# EAGLE design PocketPowerSource4.3 (EAGLE 6.4)

## Sheet 1 of 3
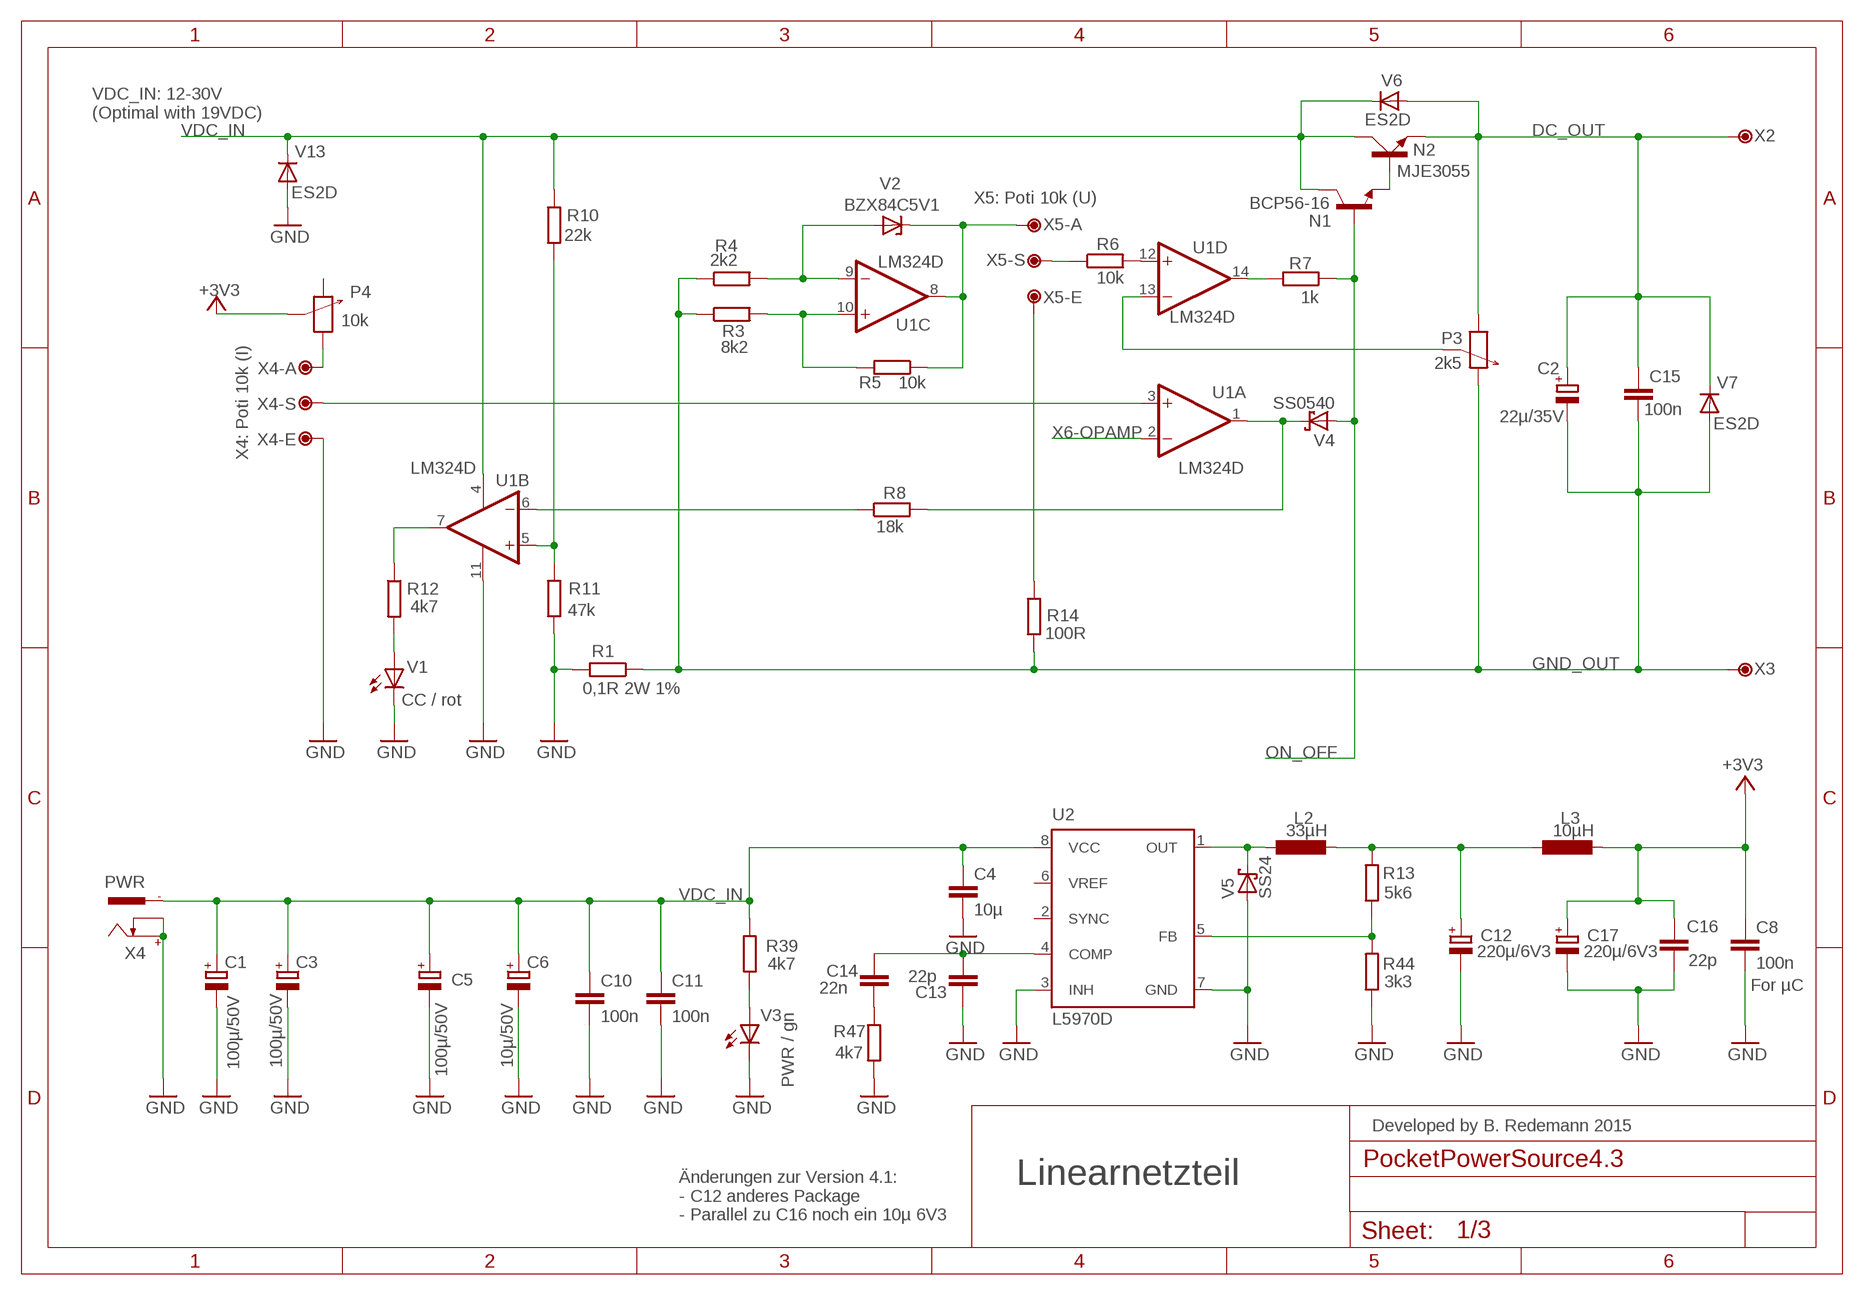
[diagram p0: schematic, sheet 1]

### Parts
C1  100µ/50V  CPOL-EUF  [PANASONIC_F]
C2  22µ/35V  CPOL-EUC  [PANASONIC_C]
C3  100µ/50V  CPOL-EUF  [PANASONIC_F]
C4  10µ  C-EUC1210  [C1210]
C5  100µ/50V  CPOL-EUF  [PANASONIC_F]
C6  10µ/50V  CPOL-EUD  [PANASONIC_D]
C8  100n  C-EUC0603K  [C0603K]
C10  100n  C-EUC0603K  [C0603K]
C11  100n  C-EUC0603K  [C0603K]
C12  220µ/6V3  CPOL-EUD  [PANASONIC_D]
C13  22p  C-EUC0805  [C0805]
C14  22n  C-EUC1206  [C1206]
C15  100n  C-EUC0603K  [C0603K]
C16  22p  C-EUC0805  [C0805]
C17  220µ/6V3  CPOL-EUD  [PANASONIC_D]
L2  33µH  L-EUWE-TPC  [POWER-CHOKE_WE-TPC]
L3  10µH  L-EUL4540  [L4540]
N1  BCP56-16  BCP56  [PG-SOT-223]
N2  MJE3055  [TO220AV]
P3  2k5  PT6  [PT6]
P4  10k  PT6  [PT6]
R1  0,1R 2W 1%  R-EU_R2512  [R2512]
R3  8k2  R-EU_R0603  [R0603]
R4  2k2  R-EU_R0805  [R0805]
R5  10k  R-EU_R0603  [R0603]
R6  10k  R-EU_R0603  [R0603]
R7  1k  R-EU_R0603  [R0603]
R8  18k  R-EU_R1206  [R1206]
R10  22k  R-EU_R0603  [R0603]
R11  47k  R-EU_R0603  [R0603]
R12  4k7  R-EU_R1206  [R1206]
R13  5k6  R-EU_R0603  [R0603]
R14  100R  R-EU_R0603  [R0603]
R39  4k7  R-EU_R1206  [R1206]
R44  3k3  R-EU_R0603  [R0603]
R47  4k7  R-EU_R1206  [R1206]
U1  LM324D  [SO14]
U2  L5970D  [SO08]
V1  CC / rot  LED3MM  [LED3MM]
V2  BZX84C5V1  BZX84CSMD  [TO236]
V3  PWR / gn  LED3MM  [LED3MM]
V4  SS0540  [SOD123]
V5  SS24  MBRS130LT3  [SMB]
V6  ES2D  [SMB]
V7  ES2D  [SMB]
V13  ES2D  [SMB]
X2  DC_OUT  TPPAD1-13  [P1-13]
X3  GND_OUT  TPPAD1-13  [P1-13]
X4  PWR  737992-55  [737992-5]
X4-A  P_I-A  TPPAD1-13  [P1-13]
X4-E  P_I-E  TPPAD1-13  [P1-13]
X4-S  P_I-W  TPPAD1-13  [P1-13]
X5-A  P_U-A  TPPAD1-13  [P1-13]
X5-E  P_U-E  TPPAD1-13  [P1-13]
X5-S  P_U-S  TPPAD1-13  [P1-13]

### Nets
+3V3: C8.1 C16.2 C17.+ L3.P$2 P4.WIPER(1S) ; also sheet 3
DC_OUT: C2.+ C15.1 N2.E P3.RIGHT(1E) V6.A V7.C X2.TP ; also sheet 2,3
GND: C1.- C3.- C4.2 C5.- C6.- C8.2 C10.2 C11.2 C12.- C13.1 C16.1 C17.- R1.2 R11.1 R44.1 R47.1 U1.11(P:V-) U2.3(INH) U2.7(GND) V1.K(C) V3.K(C) V5.A V13.A X4-E.TP X4.+ X4.K ; also sheet 2,3
GND_OUT: C2.- C15.2 P3.LEFT(1A) R1.1 R3.1 R4.1 R14.2 V7.A X3.TP ; also sheet 2,3
N$2: R8.1 U1.6(B:-IN)
N$3: R5.1 U1.8(C:OUT) V2.C X5-A.TP
N$4: R12.1 U1.7(B:OUT)
N$6: P4.RIGHT(1E) X4-A.TP
N$7: R12.2 V1.A
N$8: R8.2 U1.1(A:OUT) V4.C
N$10: R3.2 R5.2 U1.10(C:+IN)
N$11: R4.2 U1.9(C:-IN) V2.A
N$12: N1.3(E) N2.B
N$14: R7.2 U1.14(D:OUT)
N$17: C13.2 C14.1 U2.4(COMP)
N$18: R10.1 R11.2 U1.5(B:+IN)
N$19: R6.2 U1.12(D:+IN)
N$20: P3.WIPER(1S) U1.13(D:-IN)
N$21: R6.1 X5-S.TP
N$23: R14.1 X5-E.TP
N$24: U1.3(A:+IN) X4-S.TP
N$25: C12.+ L2.2 L3.P$1 R13.2
N$35: R39.1 V3.A
N$59: R13.1 R44.2 U2.5(FB)
N$60: C14.2 R47.2
N$61: L2.1 U2.1(OUT) V5.C
ON_OFF: N1.1(B) R7.1 V4.A ; also sheet 2
VDC_IN: C1.+ C3.+ C4.1 C5.+ C6.+ C10.1 C11.1 N1.2(C) N1.4(C) N2.C R10.2 R39.2 U1.4(P:V+) U2.8(VCC) V6.C V13.C X4.-1 ; also sheet 2
X6-OPAMP: U1.2(A:-IN) ; also sheet 2
Unconnected: P4.LEFT(1A) U2.2(SYNC) U2.6(VREF) X4.-2

### Notes on the sheet
- VDC_IN: 12-30V
  (Optimal with 19VDC)
- X5: Poti 10k (U)
- X4: Poti 10k (I)
- For µC
- Developed by B. Redemann 2015
- Linearnetzteil
- Änderungen zur Version 4.1:
  - C12 anderes Package
  - Parallel zu C16 noch ein 10µ 6V3

## Sheet 2 of 3
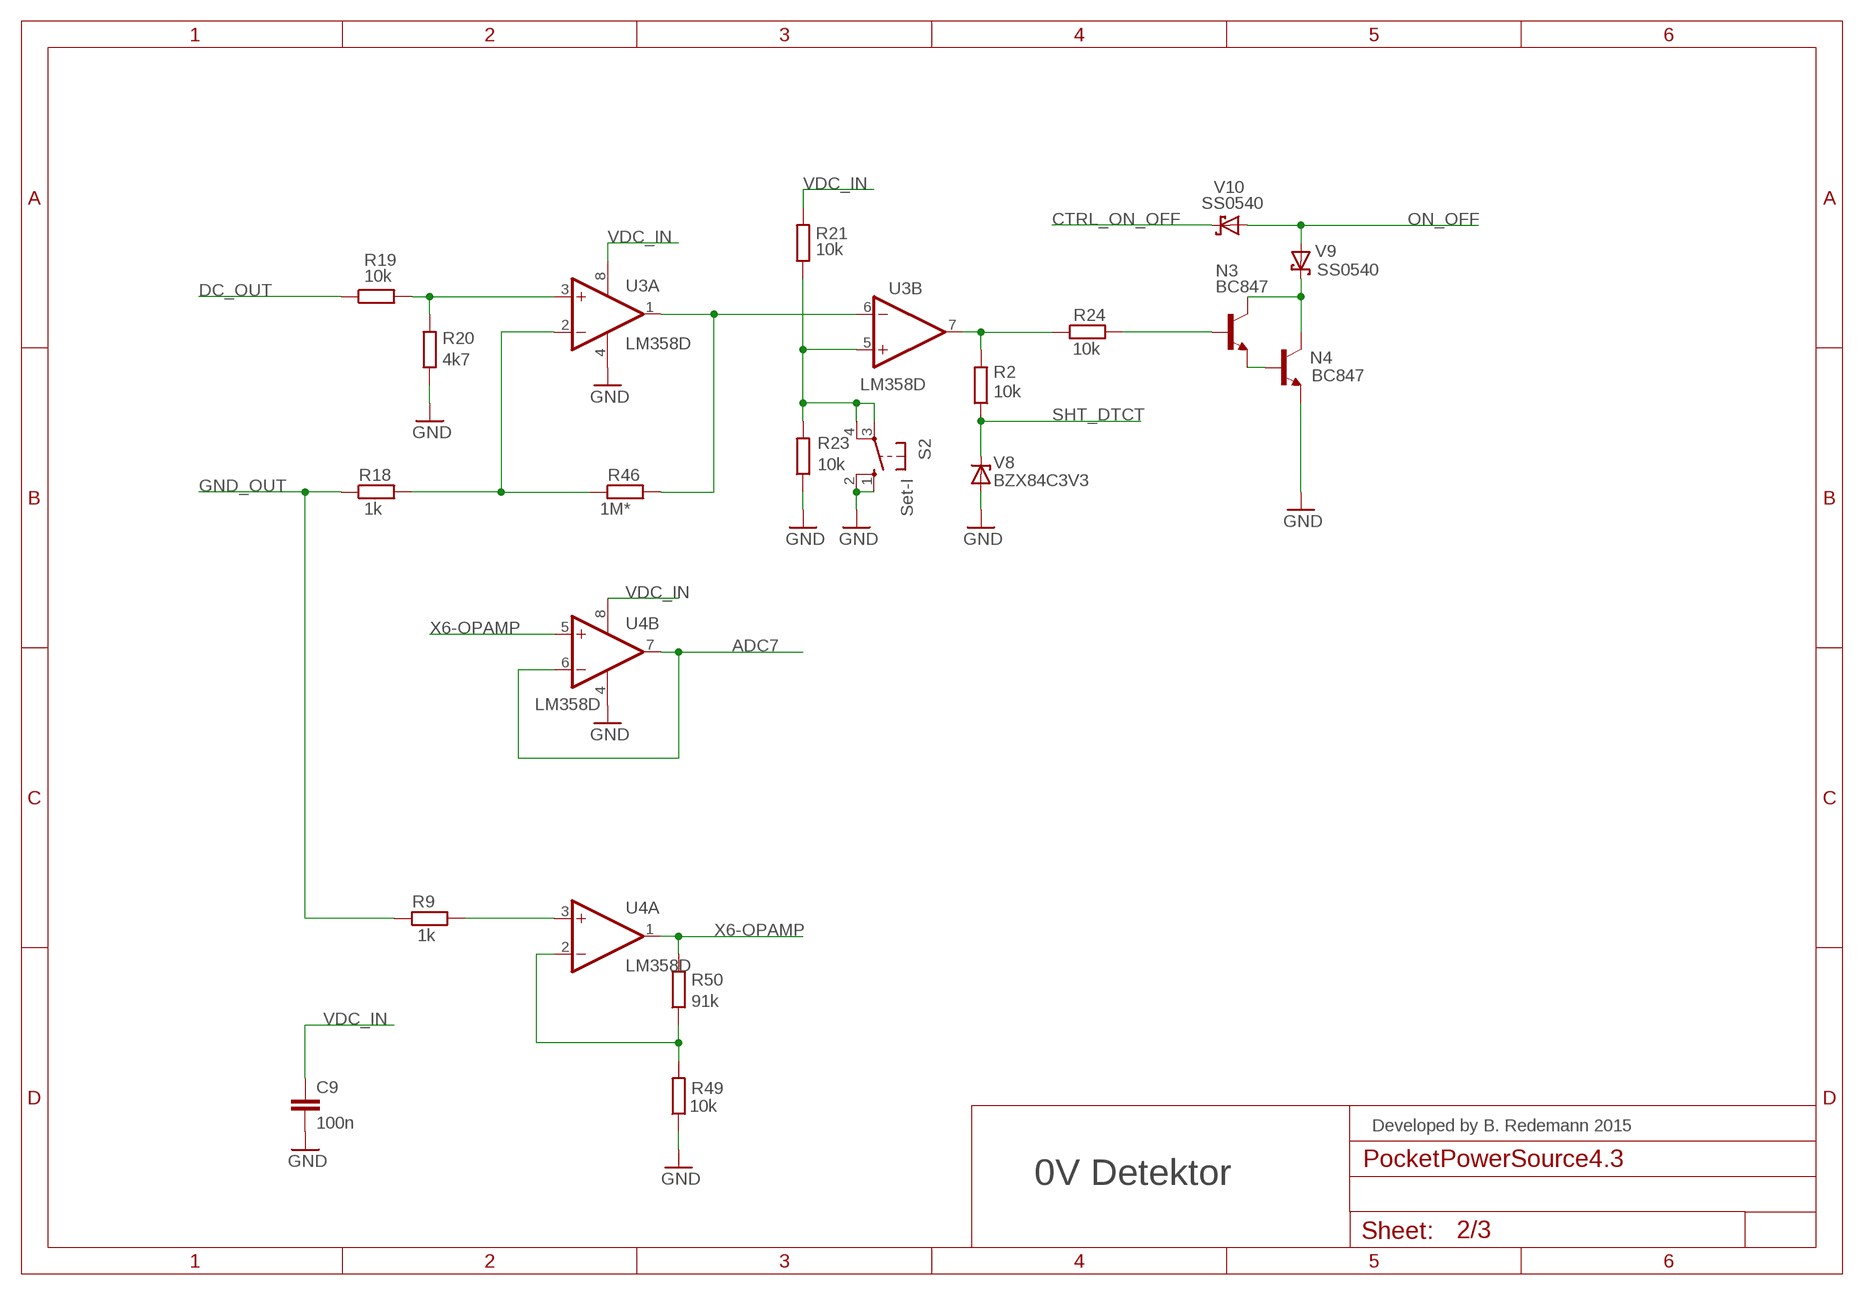
[diagram p1: schematic, sheet 2]

### Parts
C9  100n  C-EUC0603K  [C0603K]
N3  BC847  [SOT23]
N4  BC847  [SOT23]
R2  10k  R-EU_R0603  [R0603]
R9  1k  R-EU_R0603  [R0603]
R18  1k  R-EU_R0603  [R0603]
R19  10k  R-EU_R0603  [R0603]
R20  4k7  R-EU_R1206  [R1206]
R21  10k  R-EU_R0603  [R0603]
R23  10k  R-EU_R0603  [R0603]
R24  10k  R-EU_R0603  [R0603]
R46  1M*  R-EU_R0603  [R0603]
R49  10k  R-EU_R0603  [R0603]
R50  91k  R-EU_R0805  [R0805]
S2  Set-I  10-XX  [B3F-10XX]
U3  LM358D  [SO08]
U4  LM358D  [SO08]
V8  BZX84C3V3  BZX84CSMD  [TO236]
V9  SS0540  [SOD123]
V10  SS0540  [SOD123]

### Nets
ADC7: U4.6(B:-IN) U4.7(B:OUT) ; also sheet 3
CTRL_ON_OFF: V10.C ; also sheet 3
DC_OUT: R19.1 ; also sheet 1,3
GND: C9.2 N4.2(E) R20.1 R23.1 R49.1 S2.1(S) S2.2(S1) U3.4(P:V-) U4.4(P:V-) V8.A ; also sheet 1,3
GND_OUT: R9.1 R18.1 ; also sheet 1,3
N$1: R19.2 R20.2 U3.3(A:+IN)
N$5: R9.2 U4.3(A:+IN)
N$9: N3.1(B) R24.2
N$13: R2.2 R24.1 U3.7(B:OUT)
N$27: R18.2 R46.1 U3.2(A:-IN)
N$28: R46.2 U3.1(A:OUT) U3.6(B:-IN)
N$29: R21.1 R23.2 S2.3(P) S2.4(P1) U3.5(B:+IN)
N$30: R49.2 R50.1 U4.2(A:-IN)
N$31: N3.2(E) N4.1(B)
N$34: N3.3(C) N4.3(C) V9.C
ON_OFF: V9.A V10.A ; also sheet 1
SHT_DTCT: R2.1 V8.C ; also sheet 3
VDC_IN: C9.1 R21.2 U3.8(P:V+) U4.8(P:V+) ; also sheet 1
X6-OPAMP: R50.2 U4.1(A:OUT) U4.5(B:+IN) ; also sheet 1

### Notes on the sheet
- Developed by B. Redemann 2015
- 0V Detektor

## Sheet 3 of 3
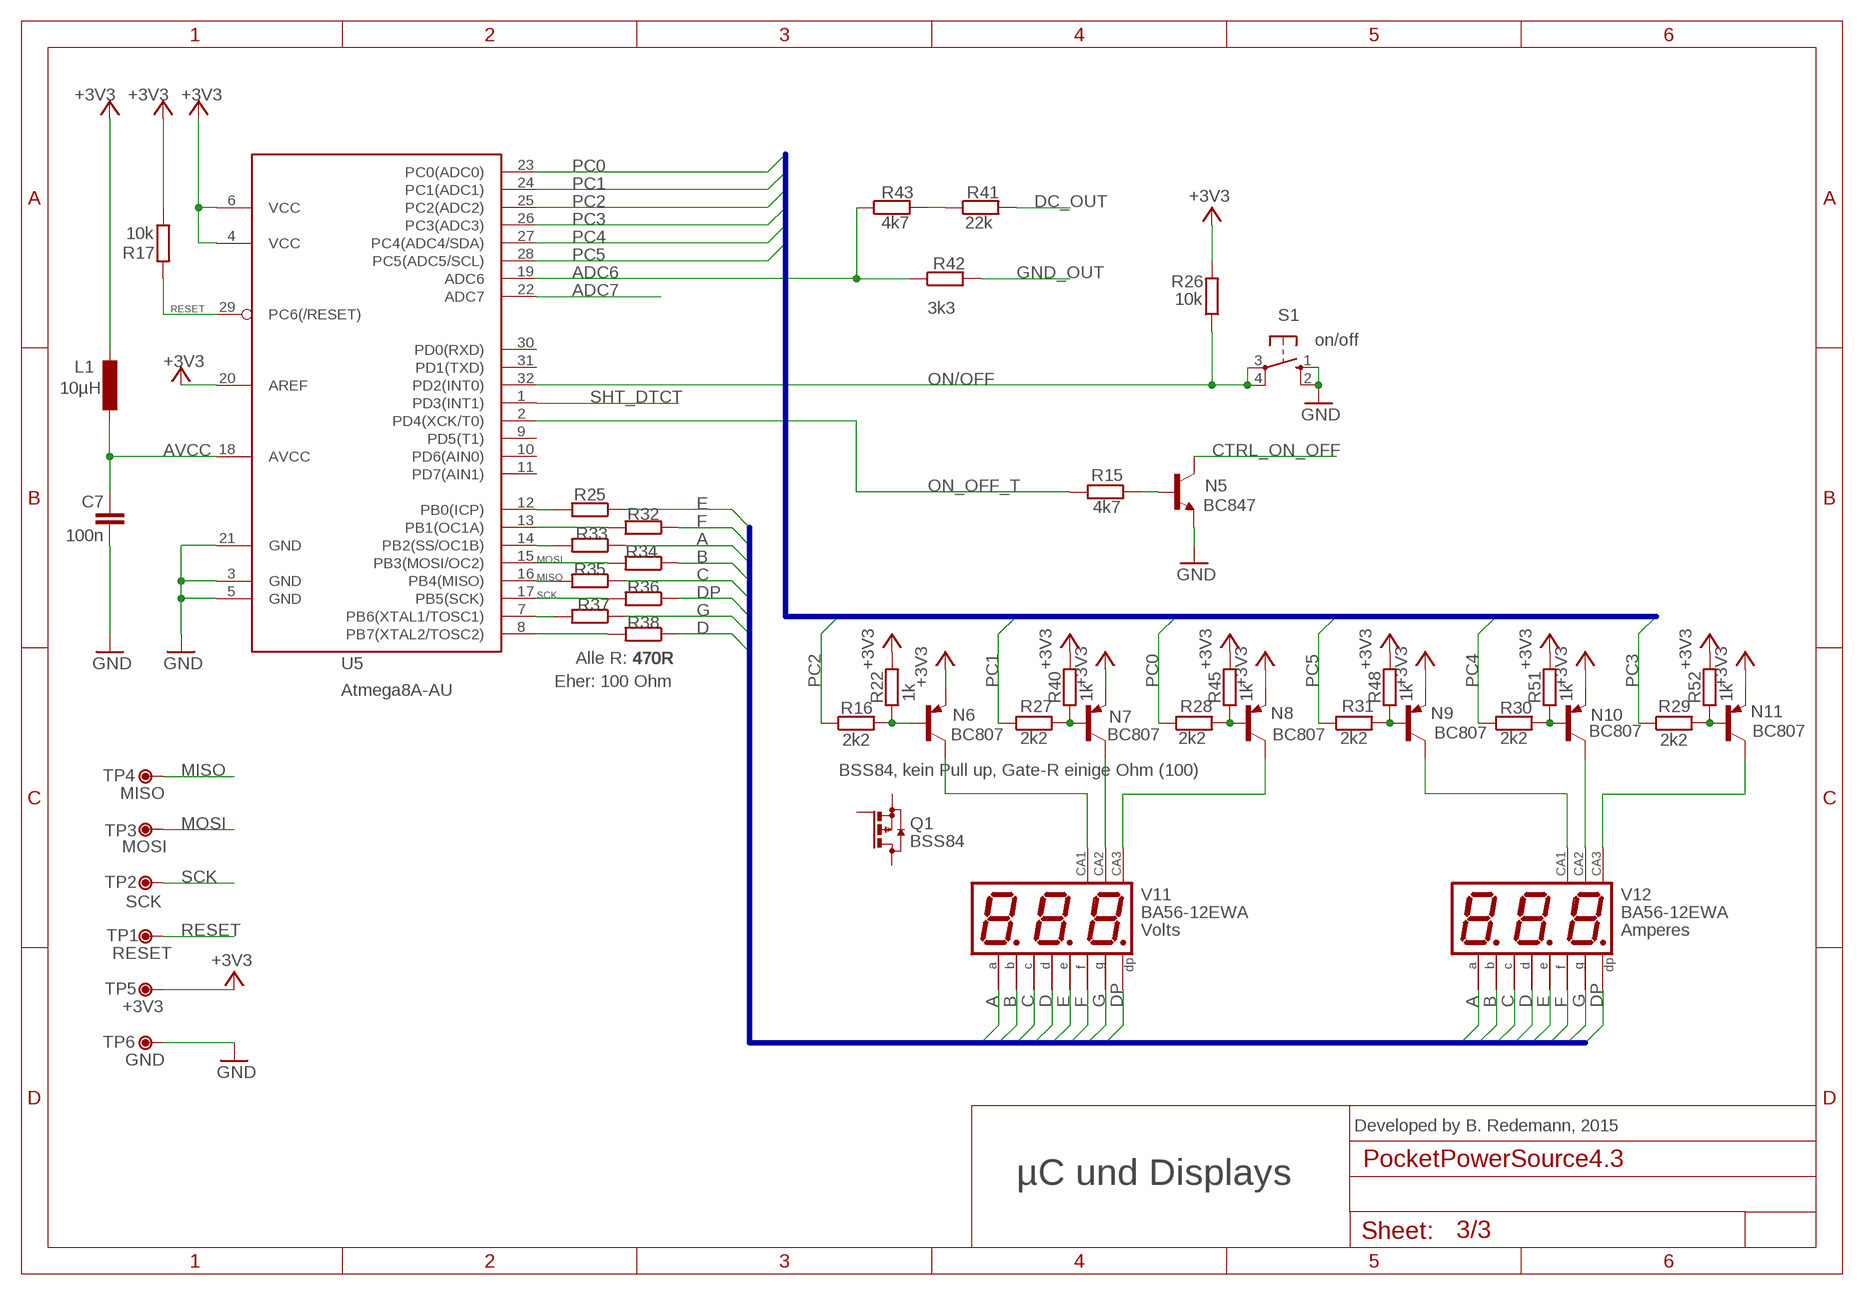
[diagram p2: schematic, sheet 3]

### Parts
C7  100n  C-EUC0603K  [C0603K]
L1  10µH  L-EUL2825P  [L2825P]
N5  BC847  [SOT23]
N6  BC807  BC807-16-PNP-SOT23-BEC  [SOT23-BEC]
N7  BC807  BC807-16-PNP-SOT23-BEC  [SOT23-BEC]
N8  BC807  BC807-16-PNP-SOT23-BEC  [SOT23-BEC]
N9  BC807  BC807-16-PNP-SOT23-BEC  [SOT23-BEC]
N10  BC807  BC807-16-PNP-SOT23-BEC  [SOT23-BEC]
N11  BC807  BC807-16-PNP-SOT23-BEC  [SOT23-BEC]
Q1  BSS84  [SOT23]
R15  4k7  R-EU_R1206  [R1206]
R16  2k2  R-EU_R1206  [R1206]
R17  10k  R-EU_R0603  [R0603]
R22  1k  R-EU_R0603  [R0603]
R25  470R  R-EU_R0805  [R0805]
R26  10k  R-EU_R0603  [R0603]
R27  2k2  R-EU_R1206  [R1206]
R28  2k2  R-EU_R1206  [R1206]
R29  2k2  R-EU_R1206  [R1206]
R30  2k2  R-EU_R1206  [R1206]
R31  2k2  R-EU_R1206  [R1206]
R32  470R  R-EU_R0805  [R0805]
R33  470R  R-EU_R0805  [R0805]
R34  470R  R-EU_R0805  [R0805]
R35  470R  R-EU_R0805  [R0805]
R36  470R  R-EU_R0805  [R0805]
R37  470R  R-EU_R0805  [R0805]
R38  470R  R-EU_R0805  [R0805]
R40  1k  R-EU_R0603  [R0603]
R41  22k  R-EU_R0603  [R0603]
R42  3k3  R-EU_R0603  [R0603]
R43  4k7  R-EU_R1206  [R1206]
R45  1k  R-EU_R0603  [R0603]
R48  1k  R-EU_R0603  [R0603]
R51  1k  R-EU_R0603  [R0603]
R52  1k  R-EU_R0603  [R0603]
S1  on/off  10-XX  [B3F-10XX]
TP1  RESET  TPPAD1-13  [P1-13]
TP2  SCK  TPPAD1-13  [P1-13]
TP3  MOSI  TPPAD1-13  [P1-13]
TP4  MISO  TPPAD1-13  [P1-13]
TP5  +3V3  TPPAD1-13  [P1-13]
TP6  GND  TPPAD1-13  [P1-13]
U5  Atmega8A-AU  MEGA8-AI  [TQFP32-08]
V11  BA56-12EWA  [BX56-12]
V12  BA56-12EWA  [BX56-12]

### Nets
+3V3: L1.1 N6.E N7.E N8.E N9.E N10.E N11.E R17.1 R22.2 R26.2 R40.2 R45.2 R48.2 R51.2 R52.2 TP5.TP U5.4(VCC) U5.6(VCC) U5.20(AREF) ; also sheet 1
A: R33.1 V11.11(A) V12.11(A)
ADC6: R42.1 R43.1 U5.19(ADC6)
ADC7: U5.22(ADC7) ; also sheet 2
AVCC: C7.1 L1.2 U5.18(AVCC)
B: R34.1 V11.7(B) V12.7(B)
C: R35.1 V11.4(C) V12.4(C)
CTRL_ON_OFF: N5.3(C) ; also sheet 2
D: R38.1 V11.2(D) V12.2(D)
DC_OUT: R41.2 ; also sheet 1,2
DP: R36.1 V11.3(DP) V12.3(DP)
E: R25.1 V11.1(E) V12.1(E)
F: R32.1 V11.10(F) V12.10(F)
G: R37.1 V11.5(G) V12.5(G)
GND: C7.2 N5.2(E) S1.1(S) S1.2(S1) TP6.TP U5.3(GND) U5.5(GND) U5.21(GND) ; also sheet 1,2
GND_OUT: R42.2 ; also sheet 1,2
MISO: R35.2 TP4.TP U5.16(PB4(MISO))
MOSI: R34.2 TP3.TP U5.15(PB3(MOSI/OC2))
N$15: R41.1 R43.2
N$22: N5.1(B) R15.1
N$26: N6.B R16.2 R22.1
N$36: R25.2 U5.12(PB0(ICP))
N$37: R32.2 U5.13(PB1(OC1A))
N$38: N7.B R27.2 R40.1
N$39: N8.B R28.2 R45.1
N$44: N10.B R30.2 R51.1
N$45: N7.C V11.9(CA)
N$46: N10.C V12.9(CA)
N$47: N8.C V11.8(CA)
N$48: N6.C V11.12(CA)
N$49: N9.C V12.12(CA)
N$50: N11.C V12.8(CA)
N$51: N9.B R31.2 R48.1
N$52: N11.B R29.2 R52.1
N$53: R33.2 U5.14(PB2(SS/OC1B))
N$57: R37.2 U5.7(PB6(XTAL1/TOSC1))
N$58: R38.2 U5.8(PB7(XTAL2/TOSC2))
ON/OFF: R26.1 S1.3(P) S1.4(P1) U5.32(PD2(INT0))
ON_OFF_T: R15.2 U5.2(PD4(XCK/T0))
PC0: R28.1 U5.23(PC0(ADC0))
PC1: R27.1 U5.24(PC1(ADC1))
PC2: R16.1 U5.25(PC2(ADC2))
PC3: R29.1 U5.26(PC3(ADC3))
PC4: R30.1 U5.27(PC4(ADC4/SDA))
PC5: R31.1 U5.28(PC5(ADC5/SCL))
RESET: R17.2 TP1.TP U5.29(PC6(/RESET))
SCK: R36.2 TP2.TP U5.17(PB5(SCK))
SHT_DTCT: U5.1(PD3(INT1)) ; also sheet 2
Unconnected: Q1.1(G) Q1.2(S) Q1.3(D) U5.9(PD5(T1)) U5.10(PD6(AIN0)) U5.11(PD7(AIN1)) U5.30(PD0(RXD)) U5.31(PD1(TXD))

### Buses
A,B,C,D,E,F,G,DP
PC0,PC1,PC2,PC3,PC4,PC5

### Notes on the sheet
- Alle R:
- Eher: 100 Ohm
- BSS84, kein Pull up, Gate-R einige Ohm (100)
- Volts | Amperes
- Developed by B. Redemann, 2015
- µC und Displays

## Library data of the parts
C1-C3 C5 C6 C12 C17 = rcl:CPOL-EU: POLARIZED CAPACITOR, European symbol
C4 C7-C11 C13-C16 = rcl:C-EU: CAPACITOR, European symbol
L1 = resistor:L-EU: INDUCTOR, European symbol
L2 L3 = rcl:L-EU: INDUCTOR, European symbol
N1 = infineon:BCP56*
N2 = transistor-power:MJE3055: NPN TRANSISTOR
N3-N5 = transistor-neu-to92:BC847: NPN TRANSISTOR
N6-N11 = transistor:*-PNP-: PNP Transistror
P3 P4 = piher:PT6
Q1 = transistor-small-signal:BSS84: P-CHANNEL MOS FET
R1-R52 = rcl:R-EU_: RESISTOR, European symbol
S1 S2 = switch-omron:10-XX: OMRON SWITCH; MPN: B3F-1000; OC_FARNELL: 176432; OC_NEWARK: 36M3542
TP1-TP6 X2 X3 X4-A X4-E X4-S X5-A X5-E X5-S = testpad:TP: Test pad
U1 = linear:LM324: OP AMP; MF: STMicroelectronics
U2 = st-microelectronics:L5970D; MF: STMicroelectronics
U3 U4 = linear:LM358: OP AMP also LM158; LM258; LM2904 Source: http://cache.national.com/ds/LM/LM158.pdf; MF: STMicroelectronics
U5 = atmel:MEGA8: MICROCONTROLLER 8 Kbytes FLASH, 1 kbytes SRAM, 512 bytes EEPROM, USART, 6-channel 10 bit ADC, 2-channel 8 bit ADC Pin compatible with Atmega48, ATMega88, ATMega168 Source: avr.lbr; MPN: ATMEGA8-16AU; OC_FARNELL: 9171371; OC_NEWARK: 73M8863
V1 V3 = led:LED: LED OSRAM: - CHIPLED LG R971, LG N971, LY N971, LG Q971, LY Q971, LO R971, LY R971 LH N974, LH R974 LS Q976, LO Q976, LY Q976 LO Q996 - Hyper CHIPLED LW Q18S LB Q993, LB Q99A, LB R99A - SideLED LS A670, LO A670, LY A670, LG A670, LP A670 LB A673, LV A673, LT A673, LW A673 LH A674 LY A675 LS A676, LA A676, LO A676, LY A676, LW A676 LS A679, LY A679, LG A679 - Hyper Micro SIDELED® LS Y876, LA Y876, LO Y876, LY Y876 LT Y87S - SmartLED LW L88C, LW L88S LB L89C, LB L89S, LG L890 LS L89K, LO L89K, LY L89K LS L896, LA L896, LO L896, LY L896 - TOPLED LS T670, LO T670, LY T670, LG T670, LP T670 LSG T670, LSP T670, LSY T670, LOP T670, LYG T670 LG T671, LOG T671, LSG T671 LB T673, LV T673, LT T673, LW T673 LH T674 LS T676, LA T676, LO T676, LY T676, LB T676, LH T676, LSB T676, LW T676 LB T67C, LV T67C, LT T67C, LS T67K, LO T67K, LY T67K, LW E67C LS E67B, LA E67B, LO E67B, LY E67B, LB E67C, LV E67C, LT E67C LW T67C LS T679, LY T679, LG T679 LS T770, LO T770, LY T770, LG T770, LP T770 LB T773, LV T773, LT T773, LW T773 LH T774 LS E675, LA E675, LY E675, LS T675 LS T776, LA T776, LO T776, LY T776, LB T776 LHGB T686 LT T68C, LB T68C - Hyper Mini TOPLED® LB M676 - Mini TOPLED Santana® LG M470 LS M47K, LO M47K, LY M47K Source: http://www.osram.convergy.de LUXEON: - LUMILED® LXK2-PW12-R00, LXK2-PW12-S00, LXK2-PW14-U00, LXK2-PW14-V00 LXK2-PM12-R00, LXK2-PM12-S00, LXK2-PM14-U00 LXK2-PE12-Q00, LXK2-PE12-R00, LXK2-PE12-S00, LXK2-PE14-T00, LXK2-PE14-U00 LXK2-PB12-K00, LXK2-PB12-L00, LXK2-PB12-M00, LXK2-PB14-N00, LXK2-PB14-P00, LXK2-PB14-Q00 LXK2-PR12-L00, LXK2-PR12-M00, LXK2-PR14-Q00, LXK2-PR14-R00 LXK2-PD12-Q00, LXK2-PD12-R00, LXK2-PD12-S00 LXK2-PH12-R00, LXK2-PH12-S00 LXK2-PL12-P00, LXK2-PL12-Q00, LXK2-PL12-R00 Source: www.luxeon.com KINGBRIGHT: KA-3528ASYC Source: www.kingbright.com
V2 V8 = diode:BZX84CSMD: Z DIODE
V4 V9 V10 = diode:SS0540
V5 = diode:MBRS130LT3: Schottky Power Rectifier Source: http://www.onsemi.com/pub/Collateral/MBRS130LT3-D.PDF
V6 V7 V13 = diode:ES2D: DIODE super fast rectifier, 2 A; OC_REICHELT: ES 2D SMD
V11 V12 = display-kingbright:B?56-12*WA: 14.22mm (0.56INCH) THREE DIGIT NUMERIC DISPLAY Source: http://www.kingbright.com .. BA56-11EWA(Ver1189474895.pdf; OC_FARNELL: unknown; OC_NEWARK: unknown
X4 = con-conrad:737992-55: FEMALE PRINT CONNECTOR DIN 45323 (34V/3A), ROKA, distributor Conrad

## Board
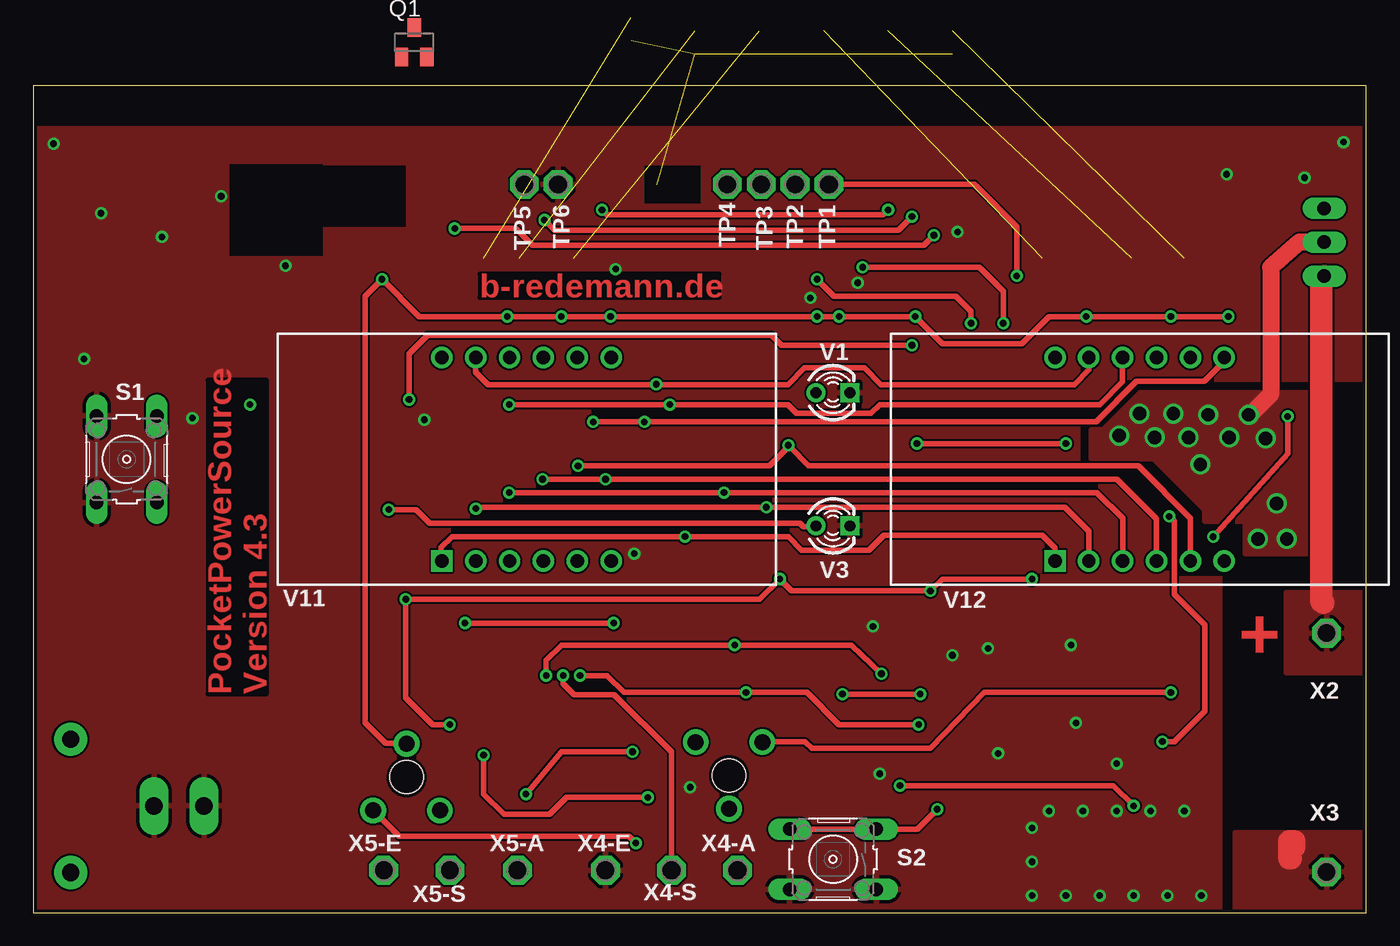
[diagram p3: board, top side]
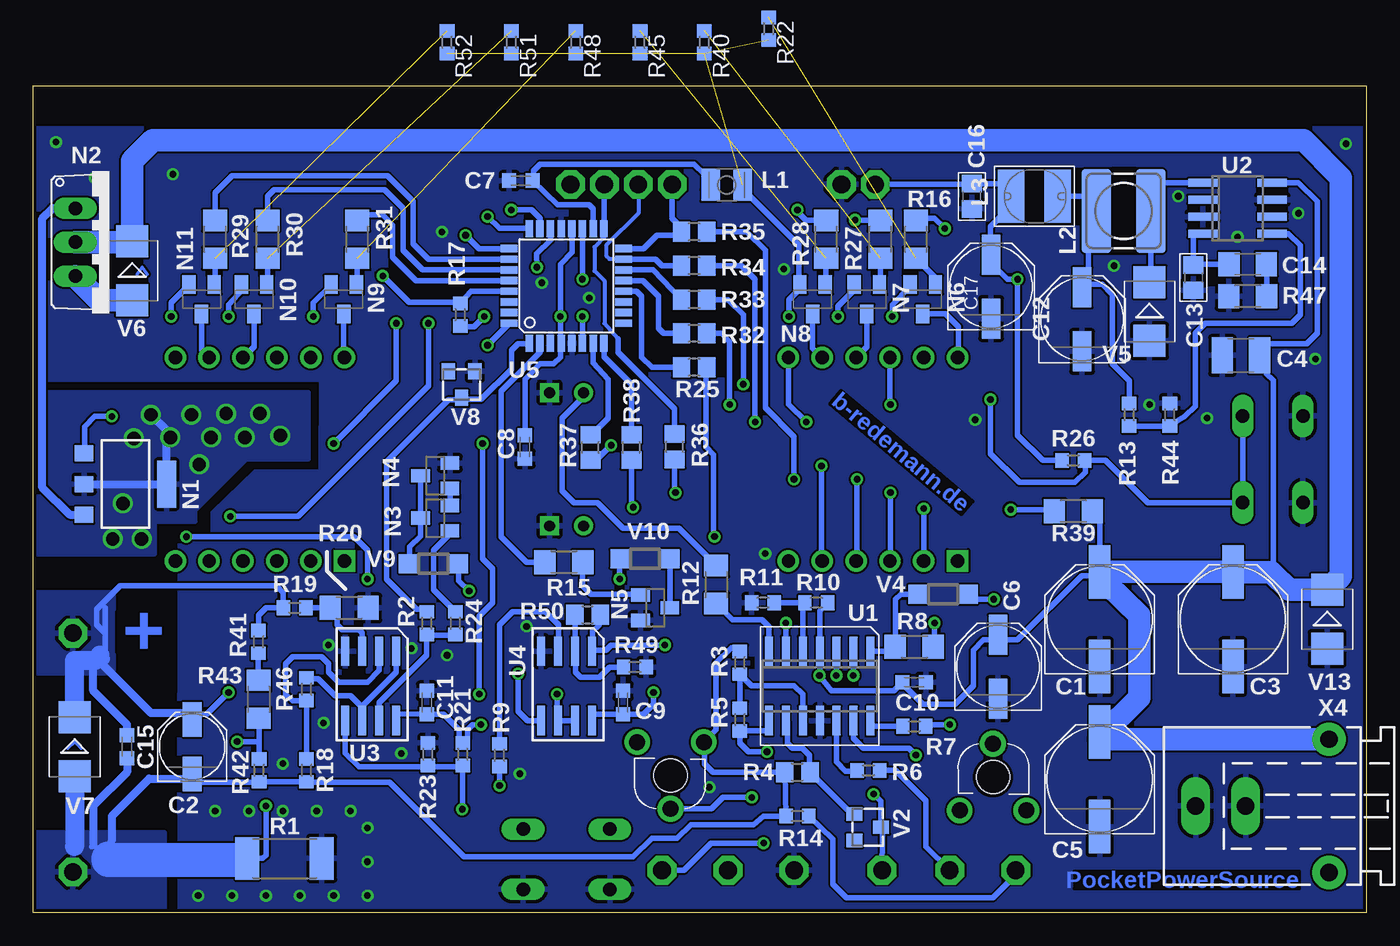
[diagram p4: board, bottom side, seen from below]

Size 100 x 62 mm. Coordinates in mm from the lower left corner, seen from the top.
Outline: 0,0 100,0 100,62 0,62 0,0
Copper layers (1*16): Top 0.035mm / dielectric 1.5mm / Bottom 0.035mm
Design rules "DFRobot_Eagle_Rule_v0.4": minimum track width 6mil, minimum drill 12mil, track to track 6mil, track to pad 6mil, pad to pad 6mil, via to via 6mil, smd to smd 0mil, copper to edge 10mil, drill to drill 10mil, minimum pad ring 12mil, minimum via ring 8mil, stop-mask expansion 2mil, vias tented up to drill 25mil, thermal gap 10mil
tKeepout: area 0,59 to 99.9,62
bKeepout: area 0,59 to 99.9,62
tRestrict: area 0,59 to 100.2,62; area 14.7,49.3 to 21.7,56.1; area 21.7,51.4 to 27.9,56; area 45.8,53.2 to 50,56; area 86,25.3 to 89.2,25.4
bRestrict: area 0,59 to 100.2,62; area 17.3,49.3 to 19.1,55.9; area 61,41.5 to 61.5,42.1; area 6.7,53.8 to 7.5,54.2; area 6.5,52.6 to 7.5,53.2; area 48.1,40.1 to 48.6,42.4; area 58.5,52.1 to 59.8,52.7; area 60.7,42.4 to 60.9,43.1; area 61.5,42.5 to 61.6,42.9; area 60,50.9 to 60.1,51.6; area 60.7,50.9 to 60.8,51.6; area 45.9,18.3 to 46.2,19.2; area 24.3,51.6 to 25.5,55.9; area 47.6,53.3 to 48.2,55.9; area 75.1,17.7 to 76.8,18.3; area 73.2,48.2 to 73.4,48.9; area 11.3,47 to 11.9,47.2; area 21.5,51.6 to 22,55.9

### Footprints (pad centres in the part's own frame; a part is rotated, then mirrored left to right if it is on the bottom)
PANASONIC_F = smd 4 x 1.6: + 3.55,0; - -3.55,0
PANASONIC_C = smd 2.6 x 1.4: + 2.05,0; - -2.05,0
C1210 = smd 1.6 x 2.7: 1 -1.4,0; 2 1.4,0
PANASONIC_D = smd 3 x 1.4: + 2.4,0; - -2.4,0
C0603K = smd 1.05 x 1.08: 1 -0.875,0; 2 0.875,0
C0805 = smd 1.3 x 1.5: 1 -0.95,0; 2 0.95,0
C1206 = smd 1.6 x 1.8: 1 -1.4,0; 2 1.4,0
L2825P = smd 1.4 x 2.4: 1 -1.2,0; 2 1.2,0
POWER-CHOKE_WE-TPC = smd 6.3 x 2.2: 1 0,2.05; 2 0,-2.05
L4540 = smd 2 x 4: P$1 -1.75,0; P$2 1.75,0
PG-SOT-223 = smd 1.2 x 1.4: 1 -2.311,-3.099; 2 0,-3.099; 3 2.311,-3.099 | smd 3.5 x 1.4: 4 0,3.099
TO220AV = drill 1.016 long: B -2.54,-2.54; C 0,-2.54; E 2.54,-2.54
SOT23 = smd 1 x 1.4: 1 -0.95,-1.1; 2 0.95,-1.1; 3 0,1.1
SOT23-BEC = smd 1 x 1.4: B -0.95,-1.1; C 0,1.1; E 0.95,-1.1
PT6 = drill 1.2 pad 1.93: LEFT -2.5,-2.5; RIGHT 2.5,-2.5; WIPER 0,2.5 | hole 2.5: 0,0
R2512 = smd 1.8 x 3.2: 1 -2.8,0; 2 2.8,0
R0603 = smd 1 x 1.1: 1 -0.85,0; 2 0.85,0
R0805 = smd 1.3 x 1.5: 1 -0.95,0; 2 0.95,0
R1206 = smd 1.6 x 1.803: 1 -1.422,0; 2 1.422,0
B3F-10XX = drill 1.016 long: 1 -3.251,2.261; 2 3.251,2.261; 3 -3.251,-2.261; 4 3.251,-2.261
P1-13 = drill 1.321 pad 2.159 octagon: TP 0,0
SO14 = smd 0.6 x 2.2: 1 -3.81,-2.6; 2 -2.54,-2.6; 3 -1.27,-2.6; 4 0,-2.6; 5 1.27,-2.6; 6 2.54,-2.6; 7 3.81,-2.6; 8 3.81,2.6; 9 2.54,2.6; 10 1.27,2.6; 11 0,2.6; 12 -1.27,2.6; 13 -2.54,2.6; 14 -3.81,2.6
SO08 = smd 0.6 x 2.2: 1 -1.905,-2.6; 2 -0.635,-2.6; 3 0.635,-2.6; 4 1.905,-2.6; 5 1.905,2.6; 6 0.635,2.6; 7 -0.635,2.6; 8 -1.905,2.6
TQFP32-08 = smd 1.27 x 0.559: 1 -4.293,2.8; 2 -4.293,2; 3 -4.293,1.2; 4 -4.293,0.4; 5 -4.293,-0.4; 6 -4.293,-1.2; 7 -4.293,-2; 8 -4.293,-2.8; 17 4.293,-2.8; 18 4.293,-2; 19 4.293,-1.2; 20 4.293,-0.4; 21 4.293,0.4; 22 4.293,1.2; 23 4.293,2; 24 4.293,2.8 | smd 0.559 x 1.27: 9 -2.8,-4.293; 10 -2,-4.293; 11 -1.2,-4.293; 12 -0.4,-4.293; 13 0.4,-4.293; 14 1.2,-4.293; 15 2,-4.293; 16 2.8,-4.293; 25 2.8,4.293; 26 2,4.293; 27 1.2,4.293; 28 0.4,4.293; 29 -0.4,4.293; 30 -1.2,4.293; 31 -2,4.293; 32 -2.8,4.293
LED3MM = drill 0.813 pad 1.422: A -1.27,0 | drill 0.813 pad 1.422 square: K 1.27,0
TO236 = smd 1 x 1.2: A -1,-1; C 0,1; NC 1,-1
SOD123 = smd 1.4 x 1.4: A 1.9,0; C -1.9,0
SMB = smd 2.4 x 2.4: A 2.2,0; C -2.2,0
BX56-12 = drill 1 pad 1.6 square: 1 -6.35,-7.62 | drill 1 pad 1.6: 2 -3.81,-7.62; 3 -1.27,-7.62; 4 1.27,-7.62; 5 3.81,-7.62; 6 6.35,-7.62; 7 6.35,7.62; 8 3.81,7.62; 9 1.27,7.62; 10 -1.27,7.62; 11 -3.81,7.62; 12 -6.35,7.62
737992-5 = drill 1.3 pad 2.184 long: + 0,10; K 0,6.25 | drill 1.3 pad 2.5: -1 5,0; -2 -5,0

### Placement (x,y rotation side)
C1  20,22 90 bottom
C2  88.08,12.44 90 bottom
C3  10,22 90 bottom
C4  9.4,41.78 180 bottom
C5  20,10 90 bottom
C6  27.62,18.44 90 bottom
C7  63.43,54.89 180 bottom
C8  63.12,34.92 270 bottom
C9  55.75,15.75 90 bottom
C10  33.91,17.27 0 bottom
C11  70.48,15.75 90 bottom
C12  21.32,44.49 90 bottom
C13  12.95,47.62 90 bottom
C14  8.89,48.64 0 bottom
C15  92.96,12.44 270 bottom
C16  29.59,53.72 90 bottom
C17  28.14,46.95 90 bottom
L1  47.98,54.57 180 bottom
L2  18.19,52.63 270 bottom
L3  24.89,53.72 180 bottom
N1  93.09,32.13 270 bottom
N2  94.31,50.28 270 bottom
N3  69.85,29.59 90 bottom
N4  69.85,32.77 90 bottom
N5  53.34,22.86 270 bottom
N6  33.27,46 180 bottom
N7  37.47,46 180 bottom
N8  41.53,46 180 bottom
N9  76.71,46 180 bottom
N10  83.44,46 180 bottom
N11  87.38,46 180 bottom
P3  52.2,10.29 180 bottom
P4  28,10.16 0 bottom
Q1  28.57,65.28 0 top
R1  81.15,4.06 0 bottom
R2  70.48,21.72 270 bottom
R3  46.99,18.72 270 bottom
R4  42.67,10.54 0 bottom
R5  46.99,14.48 90 bottom
R6  37.34,10.67 180 bottom
R7  33.91,13.97 180 bottom
R8  33.91,19.94 180 bottom
R9  65.02,11.81 90 bottom
R10  41.25,23.24 0 bottom
R11  45.26,23.24 0 bottom
R12  48.77,24.6 90 bottom
R13  17.78,37.34 90 bottom
R14  42.67,7.24 180 bottom
R15  60.2,26.29 180 bottom
R16  33.78,50.49 270 bottom
R17  67.97,44.84 90 bottom
R18  79.5,10.67 90 bottom
R19  80.39,22.86 0 bottom
R20  76.31,22.86 180 bottom
R21  67.78,11.87 90 bottom
R22  44.83,66.29 270 bottom  (outside the outline)
R23  70.39,11.87 270 bottom
R24  68.33,21.72 90 bottom
R25  50.42,40.89 180 bottom
R26  21.97,33.91 180 bottom
R27  36.45,50.49 270 bottom
R28  40.51,50.49 270 bottom
R29  86.36,50.49 270 bottom
R30  82.42,50.49 270 bottom
R31  75.69,50.49 270 bottom
R32  50.42,43.43 180 bottom
R33  50.42,45.97 180 bottom
R34  50.42,48.51 180 bottom
R35  50.42,51.05 180 bottom
R36  51.88,34.94 90 bottom
R37  58.21,34.89 90 bottom
R38  55.13,34.88 90 bottom
R39  21.97,30.1 0 bottom
R40  49.66,65.28 270 bottom
R41  83.1,20.3 90 bottom
R42  83.06,10.67 270 bottom
R43  83.1,16 90 bottom
R44  14.73,37.34 270 bottom
R45  54.48,65.28 270 bottom
R46  79.5,16.76 90 bottom
R47  8.89,46.23 0 bottom
R48  59.31,65.28 270 bottom
R49  54.86,18.41 180 bottom
R50  58.42,22.35 0 bottom
R51  64.14,65.28 270 bottom
R52  68.96,65.28 270 bottom
S1  7,34 90 top
S2  60,4 180 top
TP1  59.69,54.61 0 top
TP2  57.15,54.61 0 top
TP3  54.61,54.61 0 top
TP4  52.07,54.61 0 top
TP5  36.83,54.61 0 top
TP6  39.37,54.61 0 top
U1  41,17 180 bottom
U2  9.65,52.83 270 bottom
U3  74.7,17 180 bottom
U4  60,17 180 bottom
U5  60,47 90 bottom
V1  60,39 0 top
V2  37.4,6.4 270 bottom
V3  60,29 0 top
V4  31.75,23.88 0 bottom
V5  16.26,45.09 270 bottom
V6  92.58,48.13 270 bottom
V7  96.9,12.44 270 bottom
V8  67.87,39.6 180 bottom
V9  69.98,26.16 0 bottom
V10  54.1,26.54 180 bottom
V11  37,34 0 top
V12  83,34 0 top
V13  2.92,22 270 bottom
X2  97.03,20.95 0 top
X3  97.03,3.05 0 top
X4  2.8,8 90 bottom
X4-A  52.83,3.17 90 top
X4-E  42.93,3.17 90 top
X4-S  47.88,3.17 90 top
X5-A  36.32,3.17 90 top
X5-E  26.29,3.17 0 top
X5-S  31.24,3.17 0 top

### Tracks (layer width: path | path; a pad name or v marks a point on that pad's centre or on a via)
+3V3  (via drill 0.5)  (6 unrouted)
  Top 0.406: v89.66,44.7 v85.34,44.7 v78.99,44.7 78.99,44.58 78.87,44.7 76.2,44.7 74.17,42.67 68.2,42.67 v66.17,44.7 v60.45,44.7 v58.8,44.7 v43.31,44.7 v39.62,44.7 v35.56,44.7 28.96,44.7 v26.16,47.5 24.89,46.23 24.89,14.22 26.42,12.7 27.96,12.7 P4.WIPER
  Bottom 0.406: v43.31,44.7 43.31,45.97 42.48,46.8 N8.E 42.55,47.17 42.55,50.04 46.19,53.68 46.7,53.68 46.86,53.85 46.86,54.48 L1.1 46.69,54.48 46.61,54.48 | v39.62,44.7 39.62,45.47 38.41,46.67 N7.E | v78.99,44.7 78.99,45.72 77.66,47.06 N9.E | v85.34,44.7 85.34,45.59 84.26,46.8 84.39,46.93 N10.E | v89.66,44.7 89.66,45.72 88.33,47.06 N11.E | 60.4,44.65 v60.45,44.7 | 58.8,44.58 v58.8,44.7 U5.6 | U5.20 59.56,51.26 59.56,49.53 60.45,48.64 v60.45,44.7 | v60.45,44.7 60.45,42.76 U5.4 60.45,42.63 60.45,41.66 60.96,41.15 61.98,41.15 63.12,40.01 C8.1 | L3.P$2 26.1,53.72 | TP5.TP 29.59,54.61 C16.2 26.64,54.67 L3.P$2 | v26.16,47.5 26.15,47.5 | L3.P$2 26.09,52.83 26.8,52.83 28.19,51.44 28.19,49.4 C17.+ 28.14,48.72 26.92,47.5 v26.16,47.5 | v66.17,44.7 66.93,43.94 67.93,43.94 R17.1 | R26.2 24.26,33.91 26.16,35.81 v26.16,47.5 | N6.E 34.22,46.93 35.56,45.59 v35.56,44.7
A  (via drill 0.5)
  Top 0.406: V11.11 33.19,40.51 34.1,39.6 46.63,39.6 | V12.11 79.2,40.7 78.1,39.6 63.6,39.6 62.35,40.85 57.85,40.85 56.6,39.6 46.63,39.6 | 46.63,39.6 v46.74,39.62
  Bottom 0.406: R33.1 47.88,45.97 46.74,44.83 v46.74,39.62
ADC6  (via drill 0.5)
  Top 0.406: v70.36,44.2 70.36,45.09 69.22,46.23 60.07,46.23 v58.8,47.5 | v85.22,29.72 85.6,29.34 85.6,23.88 87.88,21.59 87.88,15.11 85.6,12.83 v84.71,12.83
  Bottom 0.406: 83.06,12.83 R42.1 | v70.36,44.2 70.36,39.5 80.14,29.72 v85.22,29.72 | v58.8,47.5 U5.19 | v84.71,12.83 83.06,12.83 | 83.06,12.83 83.06,14.56 R43.1
ADC7  (via drill 0.5)
  Top 0.406: v62.22,48.4 70.98,48.4 72.77,46.61 v72.77,44.2 | v77.47,35.18 v66.29,35.18 | v60.71,16.38 v66.55,16.38
  Bottom 0.406: U5.22 61.2,50.43 62.23,49.4 v62.22,48.4 | v72.77,44.2 72.77,39.88 v77.47,35.18 | v66.55,16.38 66.55,22.23 65.53,23.24 65.53,25.78 66.29,26.54 v66.29,35.18 | U4.7 U4.6 60.71,14.4 v60.71,16.38
AVCC
  Bottom 0.406: U5.18 58,52.79 58.29,53.09 60.67,53.09 C7.1 62.48,54.9 62.48,55.63 61.98,56.13 50.42,56.13 49.66,55.37 49.66,54.23 49.68,54.2 L1.2
B  (via drill 0.5)
  Top 0.406: v42,36.8 v45.85,36.8 79.76,36.83 82.77,39.85 87.87,39.85 89.37,41.35 89.5,41.47 V12.7
  Bottom 0.406: V11.7 43.35,38.12 v42,36.8 | R34.1 46.86,48.51 45.85,47.5 v45.85,36.8
C  (via drill 0.5)
  Top 0.406: V12.4 84.27,29.53 81.3,32.5 v42.93,32.5 v38.2,32.5
  Bottom 0.406: v38.2,32.5 38.2,26.51 V11.4 | R35.1 46.48,51.05 45.09,49.66 45.09,37.85 42.93,35.69 v42.93,32.5
CTRL_ON_OFF
  Bottom 0.406: V10.C 52.24,26.5 N5.3
D  (via drill 0.5)
  Top 0.406: V12.2 79.19,28.61 77.4,30.4 v54.99,30.4 33.3,30.4 v33.2,30.3 33.27,30.37
  Bottom 0.406: v33.2,30.3 V11.2 | R38.1 55.13,30.54 v54.99,30.4
DC_OUT  (via drill 0.5)
  Top 0.406: v85.34,16.51 71.37,16.51 67.31,12.32 58.42,12.32 57.91,12.83 54.74,12.83 P3.RIGHT
  Top 1.676: 96.77,23.24 96.65,23.37 96.65,47.53 N2.E
  Bottom 0.406: 95.5,18.67 95.76,18.92 | 94.74,19.05 94.74,18.92 | 94.74,18.92 94.74,18.54 | C2.+ 88.23,14.99 88.11,14.86 87,14.86 v85.34,16.51 | 94.61,22.86 94.61,20.95 | 94.61,20.95 94.61,19.05 94.74,18.92 | 94.61,20.95 95.25,21.59 95.25,22.73 93.47,24.51 81.75,24.51 81.24,24 R19.1 82.54,22.86 83.1,22.3 R41.2
  Bottom 0.61: C15.1 92.96,14.1 95.5,16.64 95.5,18.67 | 94.74,18.54 91.19,14.99 88.23,14.99
  Bottom 1.016: 94.74,19.05 95,19.3
  Bottom 1.422: V7.C 96.9,18.92 95.76,18.92 95.38,18.92 95,19.3
  Bottom 1.676: V6.A 95.05,45.93 N2.E
  pour Top: 100,24 94,24 94,18 100,18
  pour Bottom: 100,24 94,24 94,18 100,18
DP  (via drill 0.5)
  Top 0.406: V12.3 81.73,29.57 79.8,31.5 v51.82,31.5 v35.7,31.5
  Bottom 0.406: v35.7,31.5 35.7,26.55 V11.3 | 51.94,34.04 51.88,33.98 R36.1 51.88,31.56 v51.82,31.5
E  (via drill 0.5)
  Top 0.406: V12.1 76.65,27.35 75.7,28.3 63.81,28.3 62.7,27.19 57.65,27.19 56.64,28.2 v48.9,28.2 31.4,28.2 30.6,27.4 30.6,26.43 V11.1
  Bottom 0.406: v48.9,28.2 48.9,28.32 48.96,28.25 48.96,34.36 49.53,34.92 49.53,40.83 R25.1
F  (via drill 0.5)
  Top 0.406: v35.7,38.1 v47.75,38.1 56.6,38.1 57.25,37.45 62.85,37.45 63.5,38.1 80,38.1 81.7,39.8 81.7,41.59 V12.10
  Bottom 0.406: V11.10 35.73,38.17 v35.7,38.1 | R32.1 48.39,43.43 47.75,42.8 v47.75,38.1
G  (via drill 0.5)
  Top 0.406: V12.5 86.81,29.59 82.9,33.5 58.17,33.53 56.8,34.9 56.77,34.9 | 56.77,34.9 56.61,34.9 55.24,33.53 40.87,33.53 v40.87,33.5 40.9,33.6 | v56.64,35.05 56.77,34.9
  Bottom 0.406: v40.87,33.5 40.87,26.57 V11.5 | R37.1 57.99,33.91 57.78,33.91 v56.64,35.05
GND  (via drill 0.5)
  other vias: 29.34,36.96 81.28,11.18 78.23,14.22 87.63,1.27 45.09,26.92 43.69,48.26 72.39,11.94 98.3,57.78 95.38,55.12 89.53,55.37 69.34,51.05 77.85,20.07 1.52,57.66 61.85,47.24 58.29,46.1 68.96,19.3 63.5,10.41 49.28,9.4 62.99,21.46 9.65,50.67 11.94,37.08 16.26,38.1 14.1,53.72 18.92,48.51 5.08,52.45 85.09,1.27 82.55,1.27 80.01,1.27 77.47,1.27 74.93,1.27 74.93,3.81 74.93,6.35 76.2,7.62 78.74,7.62 81.28,7.62 83.82,7.62 86.36,7.62 71.63,19.81 3.81,41.53
  pour Bottom: 0,62 99.97,62 100,40 78.38,40 78.4,33.02 83.32,33.05 86.51,30 86.51,28.13 89,28 88.98,25.11 89.03,7.87 88.98,6.86 88.98,0 0,0
  pour Top: 0,62 0,0 89,0 89,28 86.51,28 86.51,30 83.3,33.05 78.38,33.14 78.36,36.7 81.66,40 99.89,40 100,40.11 100,62
GND_OUT  (via drill 0.5)
  Top 0.406: v65.02,9.53 81.03,9.53 v82.55,8
  Top 1.676: 94.36,4.06 94.23,4.06 94.23,4.95 | 94.23,4.95 94.61,4.95 94.61,5.33 94.23,5.33 94.23,4.95
  Bottom 0.406: R18.1 R42.2 83.12,9.78 87.83,9.78 C2.- | R3.1 47.62,19.87 48.77,18.73 48.77,13.72 P3.LEFT 49.66,12.75 49.66,11.18 49.02,10.54 R4.1 R14.2 45.21,7.24 45.97,6.6 50.67,6.6 51.69,5.59 53.59,5.59 54.99,4.19 67.69,4.19 73.28,9.78 79.46,9.78 R18.1 | 95.5,5.08 95.63,4.95 | 94.11,5.46 94.23,5.33 | 79.38,9.72 R18.1 | R9.1 v65.02,9.53 | v82.55,8 82.55,4.32 82.8,4.06 R1.1
  Bottom 0.61: C15.2 92.96,10.54 95.5,8 95.5,5.08 | 94.11,5.46 94.11,7.24 91.31,10.04 88.43,10.04 C2.-
  Bottom 1.422: V7.A 96.9,4.95 | R1.1 84.33,4.06 84.33,3.94
  Bottom 2.54: 84.33,3.94 94.36,3.94 94.36,4.06
  pour Top: 100,0 90.19,0 90.19,6 100,6
  pour Bottom: 100,0 90.19,0 90.19,6 100,6
MISO
  Bottom 0.305: 51.62,50.8 R35.2
  Bottom 0.406: R35.2 51.37,51.37 52.07,52.07 TP4.TP | U5.16 54.21,49.8 53.21,50.8 51.62,50.8
MOSI
  Bottom 0.305: TP3.TP 54.61,52.45 57.02,50.04 57.02,49.28 56.77,49.02 55.73,49.02
  Bottom 0.406: 51.56,48.51 R34.2 52.83,48.51 53.32,49 U5.15 55.73,49.02
N$1
  Bottom 0.406: R19.2 R20.2 77.22,22.82 77.22,21.59 76.83,21.21 75.56,21.21 75.33,20.98 U3.3
N$2  (via drill 0.5)
  Top 0.406: v43.55,21.72 v32.38,21.72
  Bottom 0.406: v32.38,21.72 32.38,20.07 R8.1 | U1.6 v43.54,21.71 v43.55,21.72
N$3  (via drill 0.5)
  Top 0.406: v36.96,8.89 39.62,12.06 v44.96,12.06
  Bottom 0.406: U1.8 44.83,14.38 44.83,13.59 44.87,13.63 R5.1 46.99,12.7 46.35,12.06 v44.96,12.06 | X5-A.TP 36.3,5.7 36.3,6.4 V2.C 36.4,8.33 v36.96,8.89
N$4
  Bottom 0.406: U1.7 44.81,21.44 45.34,21.97 47.54,21.97 R12.1
N$5
  Bottom 0.406: U4.3 60.58,19.66 60.58,21.59 61.56,22.57 64.05,22.57 65.02,21.59 R9.2
N$6  (via drill 0.5)
  Top 0.406: v45.21,5.21 44.7,5.71 27.45,5.71 P4.RIGHT
  Bottom 0.406: v45.21,5.21 49.15,5.21 51.18,3.17 X4-A.TP
N$7
  Bottom 0.406: V1.A 58.73,38.68 60.33,37.08 60.33,31.62 59.44,30.73 57.66,30.73 55.75,28.83 51.56,28.83 48.77,26.04 R12.2
N$8
  Bottom 0.406: U1.1 35.67,19.6 R8.2 35.31,19.96 35.31,23.5 34.92,23.88 V4.C
N$9
  Bottom 0.406: N3.1 68.75,28.41 69.98,27.18 69.98,24.22 R24.2
N$10
  Bottom 0.406: U1.10 42.27,16.36 42.93,17.02 46.13,17.02 R3.2 R5.2
N$11
  Bottom 0.406: U1.9 43.43,14.29 43.43,12.7 43.05,12.32 42.29,12.32 41.78,11.81 41.78,10.6 R4.2 38.91,7.73 V2.A
N$12
  Bottom 0.61: N1.3 96.22,29.84 97.28,29.84 99.31,31.88 99.31,52.07 98.55,52.83 96.87,52.83 N2.B
N$13
  Bottom 0.406: U3.7 74.06,15.73 70.48,19.3 R2.2 70.16,20.8 68.65,20.8 R24.1
N$14
  Bottom 0.406: R7.2 37.19,13.97 U1.14
N$15
  Bottom 0.406: R43.2 83.12,17.91 83.12,19.42 R41.1
N$17
  Bottom 0.406: C14.1 12.95,48.64 C13.2 12.95,50.93 U2.4
N$18
  Bottom 0.406: R11.2 R10.1 42.27,23.07 U1.5
N$19
  Bottom 0.406: R6.2 38.35,10.61 39.05,10.61 39.75,11.3 39.75,14.38 U1.12
N$20  (via drill 0.5)
  Top 0.406: v46.1,8.64 40.01,8.64 38.73,7.37 35.31,7.37 33.78,8.89 v33.78,11.81
  Bottom 0.406: v33.78,11.81 34.29,12.32 37.72,12.32 38.46,13.06 U1.13 | P3.WIPER 49.11,7.79 48.26,8.64 v46.1,8.64
N$21
  Bottom 0.406: R6.1 35.31,10.67 33.02,8.38 33.02,4.95 X5-S.TP
N$22
  Bottom 0.406: N5.1 54.88,23.88 58.17,23.88 58.8,24.51 58.8,26.26 R15.1
N$23
  Bottom 0.406: R14.1 40,5.52 40,2.13 39,1.13 28,1.13 26.28,2.85 X5-E.TP 26.28,3.18
N$24  (via drill 0.5)
  Top 0.406: v39.75,17.78 39.75,17.14 40.56,16.33 43.59,16.33 47.87,12.05 47.87,3.18 X4-S.TP
  Bottom 0.406: U1.3 39.73,17.8 v39.75,17.78
N$25
  Bottom 0.406: L3.P$1 20.24,53.72 L2.2 20.24,52.58 20.83,52.58 20.83,47.09 C12.+ 20.8,47.12 19.81,47.12 19.05,46.35 19.05,41.15 17.78,39.88 R13.2
N$26  (1 unrouted)
  Bottom 0.406: N6.B 32.32,47.61 R16.2
N$27
  Bottom 0.406: U3.2 74.04,19.37 74.04,18.16 74.93,17.27 77.09,17.27 77.85,18.03 77.85,18.67 78.36,19.18 80.55,19.18 81.05,18.67 81.05,16.38 80.55,15.88 79.56,15.88 R46.1 | 79.44,15.88 R46.1 | R18.2 R46.1
N$28
  Bottom 0.406: U3.6 75.33,15.39 | U3.1 72.77,19.32 72.77,18.03 75.33,15.47 75.33,15.39 | 75.33,15.39 76.2,16.26 77.34,16.26 78.61,17.53 79.38,17.53 R46.2
N$29  (via drill 0.5)
  Top 0.406: S2.4 S2.3 66.33,6.26 v67.82,7.75
  Bottom 0.406: U3.5 76.6,11.96 75.56,10.92 70.39,10.92 | 70.39,10.92 R23.2 | 70.39,10.92 67.79,10.92 | 67.79,10.92 R21.1 | 67.79,10.92 67.79,7.78 v67.82,7.75
N$30
  Bottom 0.406: R50.1 U4.2 59.31,19.54 59.31,18.03 58.93,17.65 57.53,17.65 56.77,18.41 R49.2
N$31
  Bottom 0.406: N4.1 N3.2
N$32
  Bottom 0.254: 91.44,47.88 91.82,48.39 92.2,47.88
N$33
  Bottom 0.254: 96.39,12.32 96.9,12.83 97.41,12.32
N$34
  Bottom 0.406: N4.3 N3.3 70.95,28.24 71.75,27.43 71.75,26.28 V9.C
N$35  (via drill 0.5)
  Top 0.406: V3.A 58.69,28.96 57.78,28.96 57.53,29.21 29.72,29.21 28.7,30.23 v26.67,30.23
  Bottom 0.406: v26.67,30.23 23.05,30.23 R39.1
N$36
  Bottom 0.406: U5.12 54.73,46.6 54.36,46.23 54.36,41.66 53.59,40.89 R25.2
N$37
  Bottom 0.406: U5.13 54.26,47.4 53.09,46.23 53.09,43.81 52.7,43.43 R32.2
N$38  (1 unrouted)
  Bottom 0.406: R27.2 36.45,47.17 N7.B
N$39  (1 unrouted)
  Bottom 0.406: R28.2 40.51,47.17 N8.B
N$44  (1 unrouted)
  Bottom 0.406: R30.2 82.42,47.17 N10.B
N$45
  Bottom 0.406: N7.C 37.47,42.42 V11.9
N$46
  Bottom 0.406: N10.C 83.44,42.45 V12.9
N$47
  Bottom 0.406: N8.C 41.53,42.34 V11.8
N$48
  Bottom 0.406: N6.C 31.57,44.9 30.61,43.94 30.61,41.66 V11.12
N$49
  Bottom 0.406: N9.C 76.71,41.68 V12.12
N$50
  Bottom 0.406: N11.C 87.38,42.19 V12.8
N$51  (1 unrouted)
  Bottom 0.406: R31.2 75.69,47.17 N9.B
N$52  (1 unrouted)
  Bottom 0.406: R29.2 86.36,47.17 N11.B
N$53
  Bottom 0.406: U5.14 53.49,48.2 R33.2 51.31,45.97
N$57
  Bottom 0.406: U5.7 58,41.24 56.9,40.01 56.9,37.08 58.17,35.81 58.17,35.89 R37.2
N$58
  Bottom 0.406: U5.8 57.2,41.71 55.12,39.62 55.12,35.85 R38.2
N$59
  Bottom 0.406: U2.5 5.84,50.93 4.95,50.04 4.95,44.83 5.59,44.2 12.06,44.2 12.83,43.43 12.83,37.97 13.59,37.21 14.64,36.58 R44.2 | 14.93,36.58 R44.2 | 17.91,36.62 R13.1 R44.2
N$60
  Bottom 0.406: C14.2 7.47,48.64 R47.2
N$61
  Bottom 0.406: U2.1 16.14,54.74 | 16.26,54.74 16.14,54.74 | 16.14,54.74 L2.1 16.14,47.28 V5.C
ON/OFF  (via drill 0.5)
  Top 0.406: v65.91,42.55 56.13,42.55 55.37,43.31 29.59,43.31 28.19,41.91 v28.19,38.48
  Bottom 0.406: U5.32 64.29,44.16 v65.91,42.55 | v28.19,38.48 28.19,34.42 26.04,32.26 21.84,32.26 21.08,33.02 21.08,33.85 R26.1 | 20.95,33.84 R26.1 | S1.4 S1.3 9.28,30.73 16.38,30.73 19.56,33.91 R26.1
ON_OFF  (via drill 0.5)
  Top 0.406: v31.24,14.1 29.97,14.1 27.94,16.13 v27.94,23.5 54.48,23.5 v56.01,25.02 56.9,24.13 v67.31,24.13 68.2,25.02 v74.93,25.02 | v94.11,37.21 94.11,34.42 v88.52,28.19
  Bottom 0.406: v88.52,28.19 75.95,28.19 74.93,27.18 v74.93,25.02 | v94.11,37.21 95.38,37.21 96.14,36.45 96.14,34.49 N1.1 | V4.A 29.85,23.75 29.59,23.5 v27.94,23.5 | V9.A 68.08,24.9 v67.31,24.13 | v31.24,14.1 33.06,14.1 R7.1 | v56.01,25.02 V10.A
ON_OFF_T
  Bottom 0.406: U5.2 62,42.01 64.9,39.12 64.9,28.19 62.99,26.29 R15.2
PC0  (via drill 0.5)
  Top 0.406: v64.14,52.7 63.75,52.32 43.05,52.32 42.67,52.7 v42.66,52.7
  Bottom 0.406: v64.14,52.7 62.61,52.7 61.98,52.07 61.98,51.32 U5.23 | v42.66,52.7 42.66,52.57 42.04,51.94 40.54,51.94 R28.1
PC1  (via drill 0.5)
  Top 0.406: v38.35,51.94 v38.35,51.95 39.12,51.18 64.9,51.18 v65.91,52.2
  Bottom 0.406: v65.91,52.2 65.02,51.31 62.81,51.31 U5.24 | v38.35,51.94 36.93,51.94 R27.1
PC2  (via drill 0.5)
  Top 0.406: v31.62,51.31 36.2,51.31 37.47,50.04 66.8,50.04 v67.56,50.8
  Bottom 0.406: U5.25 64.31,49.78 66.55,49.78 v67.56,50.8 | v31.62,51.31 32.38,52.07 33.43,52.07 R16.1
PC3
  Bottom 0.406: U5.26 70.34,49 71.5,50.16 71.5,53.34 73.41,55.24 85.09,55.24 86.36,53.98 R29.1
PC4
  Bottom 0.406: U5.27 70.81,48.2 72.26,49.66 72.26,52.83 73.66,54.23 81.92,54.23 82.42,53.72 R30.1
PC5
  Bottom 0.406: U5.28 71.28,47.4 73.03,49.15 73.03,51.56 73.79,52.32 75.79,52.32 R31.1 75.69,51.94
RESET  (via drill 0.5)
  Top 0.406: TP1.TP 70.61,54.61 73.79,51.44 v73.79,47.75
  Bottom 0.406: U5.29 67.16,46.6 R17.2 68.08,45.79 71.82,45.79 v73.79,47.75
SCK
  Bottom 0.305: 56.13,43.05 57.15,44.2 57.15,47.37 57.91,48.13 57.91,49.91 57.15,50.67 57.15,51.24
  Bottom 0.406: R36.2 51.88,37.78 56.13,42.04 56.13,43.05 | 57.15,51.24 U5.17 57.2,54.56 TP2.TP
SHT_DTCT
  Bottom 0.406: R2.1 70.23,22.73 71.25,22.73 73.5,24.99 73.5,33.81 68.84,38.47 67.99,38.47 67.99,38.59 V8.C 67.9,38.5 66.4,38.5 64.14,40.77 64.14,42.16 63.63,42.67 62.84,42.67 U5.1
VDC_IN  (via drill 0.5, 1)
  Top 0.406: v66.42,14.1 60.45,14.1 58.04,16.51 v53.47,16.51 44.32,16.51 43.05,17.78 v41.02,17.78
  Top 0.61: 91.31,37.34 v91.19,37.34
  Top 1.27: N2.C 94.98,50.28 92.84,48.39 92.84,38.86 91.31,37.34
  Bottom 0.406: 72.64,14.86 72.77,14.73 72.77,14.12 U3.8 72.77,14.42 72.77,14.99 72.69,14.91 C11.1 70.43,14.86 69.22,14.86 68.07,13.72 68.07,13.01 R21.2 67.44,13.07 67.44,13.72 67.06,14.1 v66.42,14.1 | 20.96,30.16 R39.2 20,29.53 C1.+ 19.81,25.27 21.34,25.27 26.16,20.45 27.23,20.45 C6.+ 28.01,20.45 28.7,20.45 29.46,19.68 29.46,17.02 30.86,15.62 33.27,15.62 34.66,17 C10.1 35.05,17.02 35.43,16.64 40.13,16.64 v41.02,17.78 41,17.8 U1.4 41,22.64 R10.2 | U4.8 58.04,14.46 58.04,14.99 57.93,14.87 C9.1 54.22,14.87 53.47,15.62 v53.47,16.51 | 19.96,13.59 C5.+ | C5.+ 19.85,13.3 | 7.11,25.53 6.99,25.65 6.99,39.91 7.49,40.42 7.49,42.8 C4.1 7.62,42.67 4.45,42.67 3.68,43.43 3.68,53.34 5.08,54.74 U2.8 | 20,13 C5.+
  Bottom 0.61: N1.2 N1.4 90.04,32.18 90.04,36.2 v91.19,37.34
  Bottom 1.676: N2.C 92.64,50.28 V6.C 92.58,56.39 91.06,57.91 4.7,57.91 1.91,55.12 1.91,25.22 V13.C 5.79,24.2 7.11,25.53 9.98,25.53 C3.+ C1.+ 19.43,24.98 19.43,24.64 17.02,22.29 17.02,16.13 19.85,13.3 | X4.-1 20,13
  other vias: 84.13,35.64 86.67,35.64 89.72,35.64 94.04,28.02 91.88,28.02 87.56,33.61 82.99,37.42 85.53,37.42 88.14,37.34 81.47,35.77 93.28,30.69 92.46,35.56
  pour Bottom: 79.38,38.99 100.08,38.99 100.08,26.92 90.93,26.92 90.93,29.34 87.88,29.34 87.88,30.23 84.07,34.04 79.38,34.04
  pour Top: 79.38,36.2 80.26,36.2 83.06,38.99 100.08,38.99 100.08,26.92 90.93,26.92 90.93,29.34 87.88,29.34 87.88,30.23 84.07,34.04 79.38,34.04
X6-OPAMP  (via drill 0.5)
  Top 0.406: v38.48,17.78 38.48,18.92 39.62,20.07 v52.62,20.07 61.38,20.07 v63.63,17.91
  Bottom 0.406: U4.1 | U1.2 38.46,17.8 v38.48,17.78 | v52.62,20.07 56.64,20.07 57.02,19.68 58.01,19.68 U4.1 | R50.2 57.57,21.55 58.04,21.08 58.04,19.66 U4.1 | U4.5 62.91,14.4 63.63,15.11 v63.63,17.91

### Text on the board
Top: b-redemann.de | + | PocketPowerSource / Version 4.3
Bottom: b-redemann.de | + | PocketPowerSource
Document: +3,3V | GND | MISO | MOSI | SCK | RESET | CC | Spannung | Strom | On/off | PWR | OUT + | Abgleich I | Abgleich U | Set-I | Powerbuchse / (19V DC) | OUT -
tTestmark: +3V3 | GND | MISO | MOSI | SCK | RESET | ISP Connector